# Altium schematic sheet Sheet1.SchDoc
size A4
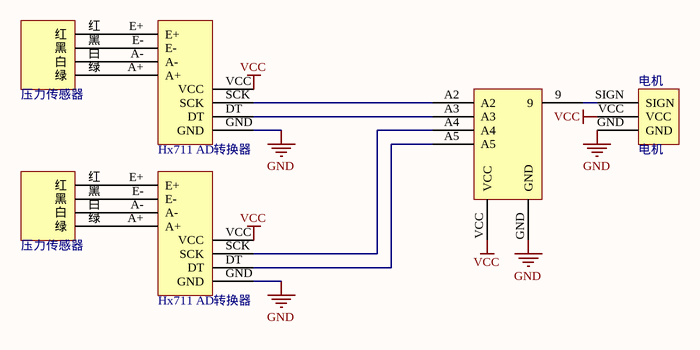
[diagram p0: Sheet1.SchDoc]

## Parts
(Parts that share a designator on the sheet are numbered #1, #2 ... from top to bottom, then left to right.)
Arduino_uno  Arduino uno  (value not drawn)
Hx711_AD转换器#1  Hx711 AD转换器  (value not drawn)
Hx711_AD转换器#2  Hx711 AD转换器  (value not drawn)
压力传感器#1  压力传感器  (value not drawn)
压力传感器#2  压力传感器  (value not drawn)
电机  电机

## Nets
GND: Arduino_uno.GND Hx711_AD转换器#1.GND Hx711_AD转换器#2.GND 电机.GND
VCC: Arduino_uno.VCC Hx711_AD转换器#1.VCC Hx711_AD转换器#2.VCC 电机.VCC
NetArduino_uno_9: Arduino_uno.9 电机.SIGN
NetArduino_uno_A2: Arduino_uno.A2 Hx711_AD转换器#1.SCK
NetArduino_uno_A3: Arduino_uno.A3 Hx711_AD转换器#1.DT
NetArduino_uno_A4: Arduino_uno.A4 Hx711_AD转换器#2.SCK
NetArduino_uno_A5: Arduino_uno.A5 Hx711_AD转换器#2.DT
NetHx711_AD转换器#1_A+: Hx711_AD转换器#1.A+ 压力传感器#1.绿
NetHx711_AD转换器#1_A-: Hx711_AD转换器#1.A- 压力传感器#1.白
NetHx711_AD转换器#1_E+: Hx711_AD转换器#1.E+ 压力传感器#1.红
NetHx711_AD转换器#1_E-: Hx711_AD转换器#1.E- 压力传感器#1.黑
NetHx711_AD转换器#2_A+: Hx711_AD转换器#2.A+ 压力传感器#2.绿
NetHx711_AD转换器#2_A-: Hx711_AD转换器#2.A- 压力传感器#2.白
NetHx711_AD转换器#2_E+: Hx711_AD转换器#2.E+ 压力传感器#2.红
NetHx711_AD转换器#2_E-: Hx711_AD转换器#2.E- 压力传感器#2.黑